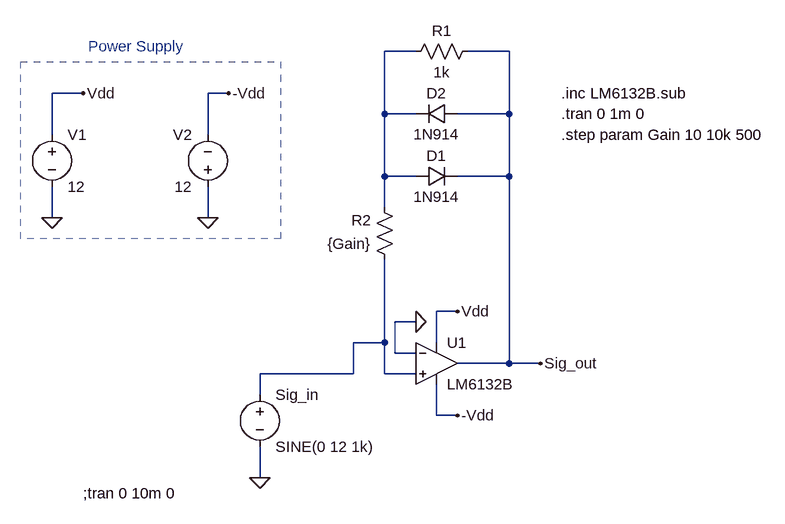
[diagram p0: schematic OD_Schem.asc]
OD_Schem.asc, the LTspice schematic file:
Version 4
SHEET 1 880 680
WIRE 224 -352 176 -352
WIRE 368 -352 304 -352
WIRE -288 -288 -336 -288
WIRE -64 -288 -96 -288
WIRE 176 -256 176 -352
WIRE 224 -256 176 -256
WIRE 368 -256 368 -352
WIRE 368 -256 288 -256
WIRE -336 -224 -336 -288
WIRE -96 -224 -96 -288
WIRE 176 -160 176 -256
WIRE 224 -160 176 -160
WIRE 368 -160 368 -256
WIRE 368 -160 288 -160
WIRE 176 -112 176 -160
WIRE -336 -96 -336 -144
WIRE -96 -96 -96 -144
WIRE 288 48 256 48
WIRE 224 64 192 64
WIRE 176 96 176 -32
WIRE 176 96 128 96
WIRE 256 96 256 48
WIRE 192 112 192 64
WIRE 224 112 192 112
WIRE 368 128 368 -160
WIRE 368 128 288 128
WIRE 416 128 368 128
WIRE 128 144 128 96
WIRE 128 144 -16 144
WIRE 176 144 176 96
WIRE 224 144 176 144
WIRE -16 176 -16 144
WIRE 256 208 256 160
WIRE 288 208 256 208
WIRE -16 304 -16 256
FLAG 288 48 Vdd
FLAG 288 208 -Vdd
FLAG -16 304 0
FLAG 416 128 Sig_out
FLAG -96 -96 0
FLAG -336 -96 0
FLAG -64 -288 -Vdd
FLAG -288 -288 Vdd
FLAG 224 64 0
SYMBOL voltage -16 160 R0
WINDOW 123 0 0 Left 0
WINDOW 39 0 0 Left 0
SYMATTR InstName Sig_in
SYMATTR Value SINE(0 12 1k)
SYMBOL OpAmps\\opamp2 256 64 R0
SYMATTR InstName U1
SYMATTR Value LM6132B
SYMBOL diode 224 -144 R270
WINDOW 0 32 32 VTop 2
WINDOW 3 0 32 VBottom 2
SYMATTR InstName D1
SYMATTR Value 1N914
SYMBOL diode 288 -272 R90
WINDOW 0 0 32 VBottom 2
WINDOW 3 32 32 VTop 2
SYMATTR InstName D2
SYMATTR Value 1N914
SYMBOL res 320 -368 R90
WINDOW 0 0 56 VBottom 2
WINDOW 3 32 56 VTop 2
SYMATTR InstName R1
SYMATTR Value 1k
SYMBOL voltage -336 -240 R0
WINDOW 123 0 0 Left 0
WINDOW 39 0 0 Left 0
SYMATTR InstName V1
SYMATTR Value 12
SYMBOL voltage -96 -128 R180
WINDOW 0 24 96 Left 2
WINDOW 3 24 16 Left 2
WINDOW 123 0 0 Left 0
WINDOW 39 0 0 Left 0
SYMATTR InstName V2
SYMATTR Value 12
SYMBOL res 192 -16 R180
WINDOW 0 36 76 Left 2
WINDOW 3 36 40 Left 2
SYMATTR InstName R2
SYMATTR Value {Gain}
TEXT 448 -288 Left 2 !.inc LM6132B.sub
TEXT 448 -256 Left 2 !.tran 0 1m 0
TEXT -280 -360 Left 2 ;Power Supply
TEXT 448 -224 Left 2 !.step param Gain 10 10k 500
TEXT -288 328 Left 2 !;tran 0 10m 0
RECTANGLE Normal 16 -64 -384 -336 2

The netlist it stands for:
* OD_Schem.asc
V§Sig_in N002 0 SINE(0 12 1k)
XU1 N002 0 Vdd -Vdd Sig_out LM6132B  ; pins In+ In- V+ V- OUT
D1 N001 Sig_out 1N914
D2 Sig_out N001 1N914
R1 Sig_out N001 1k
V1 Vdd 0 12
V2 0 -Vdd 12
R2 N002 N001 {Gain}
.model D D
.lib standard.dio
.inc LM6132B.sub
.tran 0 1m 0
* Power Supply
.step param Gain 10 10k 500
;tran 0 10m 0
.backanno
.end